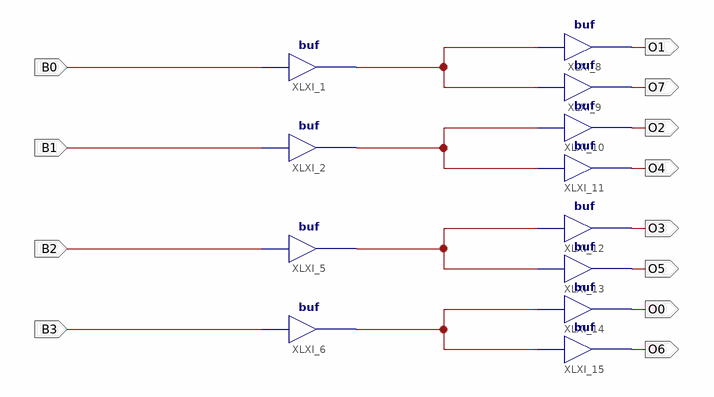
[diagram p0: schematic sheet 1]
// Xilinx ISE schematic EP.sch (xc9500xl) as structural Verilog: 12 symbols, 12 ports
module EP (
  input  B0,
  input  B1,
  input  B3,
  input  B2,
  output O1,
  output O7,
  output O2,
  output O4,
  output O3,
  output O5,
  output O0,
  output O6
);

  wire XLXN_16, XLXN_17, XLXN_21, XLXN_22;

  buf XLXI_1 (XLXN_16, B0);
  buf XLXI_2 (XLXN_17, B1);
  buf XLXI_5 (XLXN_21, B2);
  buf XLXI_6 (XLXN_22, B3);
  buf XLXI_8 (O1, XLXN_16);
  buf XLXI_9 (O7, XLXN_16);
  buf XLXI_10 (O2, XLXN_17);
  buf XLXI_11 (O4, XLXN_17);
  buf XLXI_12 (O3, XLXN_21);
  buf XLXI_13 (O5, XLXN_21);
  buf XLXI_14 (O0, XLXN_22);
  buf XLXI_15 (O6, XLXN_22);
endmodule
